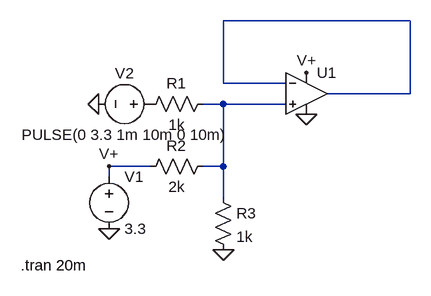
[diagram p0: schematic gate_Drive.asc]
gate_Drive.asc, the LTspice schematic file:
Version 4
SHEET 1 880 680
WIRE 368 80 80 80
WIRE 80 176 80 80
WIRE 176 176 80 176
WIRE 368 192 368 80
WIRE 368 192 240 192
WIRE 80 208 48 208
WIRE 176 208 80 208
WIRE -32 304 -96 304
WIRE 80 304 80 208
WIRE 80 304 48 304
WIRE -96 320 -96 304
WIRE 80 352 80 304
FLAG 80 432 0
FLAG -96 400 0
FLAG -96 304 V+
FLAG -112 208 0
FLAG 208 224 0
FLAG 208 160 V+
SYMBOL res 64 192 R90
WINDOW 0 0 56 VBottom 2
WINDOW 3 32 56 VTop 2
SYMATTR InstName R1
SYMATTR Value 1k
SYMBOL res 64 288 R90
WINDOW 0 0 56 VBottom 2
WINDOW 3 32 56 VTop 2
SYMATTR InstName R2
SYMATTR Value 2k
SYMBOL res 64 336 R0
SYMATTR InstName R3
SYMATTR Value 1k
SYMBOL voltage -96 304 R0
WINDOW 123 0 0 Left 0
WINDOW 39 0 0 Left 0
SYMATTR InstName V1
SYMATTR Value 3.3
SYMBOL voltage -16 208 R90
WINDOW 0 -32 56 VBottom 2
WINDOW 3 32 56 VTop 2
WINDOW 123 0 0 Left 0
WINDOW 39 0 0 Left 0
SYMATTR InstName V2
SYMATTR Value PULSE(0 3.3 1m 10m 0 10m)
SYMBOL OpAmps\\UniversalOpAmp 208 192 R0
SYMATTR InstName U1
TEXT -232 456 Left 2 !.tran 20m

The netlist it stands for:
* gate_Drive.asc
R1 N002 P001 1k
R2 N002 V+ 2k
R3 N002 0 1k
V1 V+ 0 3.3
V2 P001 0 PULSE(0 3.3 1m 10m 0 10m)
XU1 N002 N001 V+ 0 N001 level1 Avol=1Meg GBW=10Meg Vos=0 En=0 Enk=0 In=0 Ink=0 Rin=500Meg  ; pins In+ In- V+ V- OUT
.tran 20m
.lib UniversalOpAmp1.lib
.backanno
.end